# Altium project sine_wave_inverter.PrjPcb
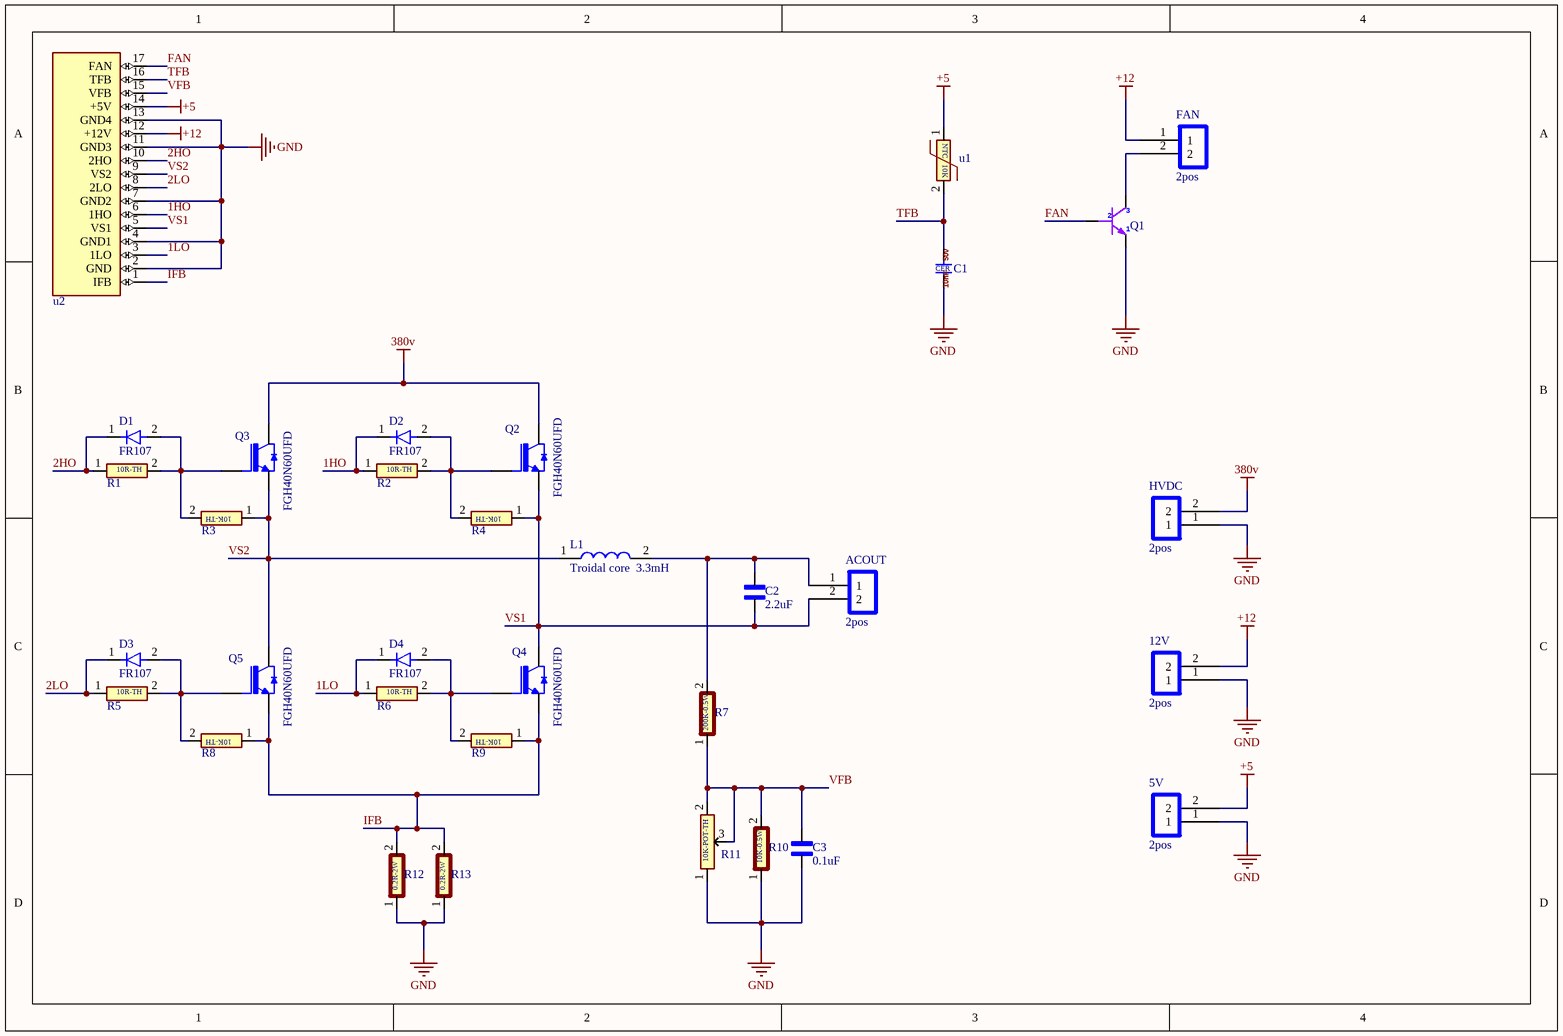
[diagram p0: inverter.SchDoc]
1 sheet, 33 parts. Net scope: global (net labels, ports and power ports of the same name join across sheets).
Board file: inverter.PcbDoc

## Sheet inverter.SchDoc
size A4; SheetNumber: 1; SheetTotal: 1

### Parts
5V  2pos  [2POS]
12V  2pos  [2POS]
ACOUT  2pos  [2POS - 3]
C1  10NFCER  [CAP-CER-2.54]  (value not drawn)
C2  2.2uF  [Cap_TH L23]
C3  0.1uF  [CAP-P_Pilm]
D1  FR107  [DIOAD1036W78L470D235]
D2  FR107  [DIOAD1036W78L470D235]
D3  FR107  [DIOAD1036W78L470D235]
D4  FR107  [DIOAD1036W78L470D235]
FAN  2pos  [2POS]
HVDC  2pos  [2POS - 3]
L1  Troidal core  3.3mH  [TOROIDAL CORE INDUCTOR]
Q1  SS8050  [TO-92]  (value not drawn)
Q2  FGH40N60UFD  [TO-247-3LD]
Q3  FGH40N60UFD  [TO-247-3LD]
Q4  FGH40N60UFD  [TO-247-3LD]
Q5  FGH40N60UFD  [TO-247-3LD]
R1  10R  [RES-TH-7mm]  (value not drawn)
R2  10R  [RES-TH-7mm]  (value not drawn)
R3  10K  [RES-TH-7mm]  (value not drawn)
R4  10K  [RES-TH-7mm]  (value not drawn)
R5  10R  [RES-TH-7mm]  (value not drawn)
R6  10R  [RES-TH-7mm]  (value not drawn)
R7  RES-0.5W-200K  [RES_TH 3W]  (value not drawn)
R8  10K  [RES-TH-7mm]  (value not drawn)
R9  10K  [RES-TH-7mm]  (value not drawn)
R10  RES-0.5W-10K  [RES_TH 3W]  (value not drawn)
R11  10K  [TRIM_3296W-1-250]  (value not drawn)
R12  RES-2W-2.1RRES-3W-0.2R  [RES_TH 3W]  (value not drawn)
R13  RES-2W-2.1RRES-3W-0.2R  [RES_TH 3W]  (value not drawn)
u1  10K  [NTC-TH L6.5]  (value not drawn)
u2  EGS002  [PinHeader_1x17_P2.54mm]  (value not drawn)

### Nets
380v: HVDC.2 Q2.2(C) Q3.2(C)
+5: 5V.2 u1.1 u2.14(+5V)
+12: 12V.2 FAN.1 u2.12(+12V)
GND: 5V.1 12V.1 C1.1 C3.1 HVDC.1 Q1.1(E) R10.1 R11.1 R12.1 R13.1 u2.2(GND) u2.4(GND1) u2.7(GND2) u2.11(GND3) u2.13(GND4)
1HO: D2.1 R2.1 u2.6(1HO)
1LO: D4.1 R6.1 u2.3(1LO)
2HO: D1.1 R1.1 u2.10(2HO)
2LO: D3.1 R5.1 u2.8(2LO)
FAN: Q1.2(B) u2.17(FAN)
IFB: Q4.3(E) Q5.3(E) R8.1 R9.1 R12.2 R13.2 u2.1(IFB)
TFB: C1.2 u1.2 u2.16(TFB)
VFB: C3.2 R7.1 R10.2 R11.2(B) R11.3 u2.15(VFB)
VS1: ACOUT.2 C2.1 Q2.3(E) Q4.2(C) R4.1 u2.5(VS1)
VS2: L1.1 Q3.3(E) Q5.2(C) R3.1 u2.9(VS2)
NetACOUT_1: ACOUT.1 C2.2 L1.2 R7.2
NetD1_2: D1.2 Q3.1(G) R1.2 R3.2
NetD2_2: D2.2 Q2.1(G) R2.2 R4.2
NetD3_2: D3.2 Q5.1(G) R5.2 R8.2
NetD4_2: D4.2 Q4.1(G) R6.2 R9.2
NetFAN_2: FAN.2 Q1.3(C)

### Notes on the sheet
- (in symbol 10K) 10K-TH
- (in symbol 10K POT) 10K-POT-TH
- (in symbol 10NFCER) 50v; CER; 10nF
- (in symbol 10R) 10R-TH
- (in symbol NTC 10K) NTC   10K
- (in symbol RES-0.5W-10K) 10K-0.5W
- (in symbol RES-0.5W-200K) 200K-0.5W
- (in symbol RES-2W-0.2R) 0.2R-2W

### Library data of the parts
5V 12V ACOUT FAN HVDC = 2pos: P2.54mm
C1 = 10NFCER: CAP: CER 1UF 50V X7R 1206; LCSC Part #: C1848; Unit Price: 0.0104
C2 = 2.2uF_film capacitor: Cap flim 2.2uF 400V; MF: KYOCERA AVX; MP: SR201C104KARTR1; SnapEDA_Link: https://www.snapeda.com/parts/SR201C104KARTR1/Kyocera/view-part/?ref=snap; Package: None; Value: *; Check_prices: https://www.snapeda.com/parts/SR201C104KARTR1/Kyocera/view-part/?ref=eda
C3 = 0.1uF_film: Cap Ceramic 0.1uF 100V X7R 10% Radial 2.54mm 125Â°C T/R; MF: KYOCERA AVX; MP: SR201C104KARTR1; SnapEDA_Link: https://www.snapeda.com/parts/SR201C104KARTR1/Kyocera/view-part/?ref=snap; Package: None; Value: *; Check_prices: https://www.snapeda.com/parts/SR201C104KARTR1/Kyocera/view-part/?ref=eda
D1-D4 = FR107: DIODE: GEN 1A 1.0V@1A 1kV DO-41 TH; LCSC Part #: C36138; Unit Price: 0.0313
L1 = Inductor: Troidal core  inductor: 220uH
Q1 = SS8050: Transistor: 25V 300mW 120@100mA,1V 1.5A NPN SOT-23; LCSC Part #: C59205; Unit Price: 0.0048
Q2-Q5 = FGH40N60UFD: FGH40N60UFD: 600V Field-Stop IGBT with ultrafast co-pack diode, 40A class, VCE(sat) typ 1.8V @ 40A/15V, TO-247-3LD (short lead) package.; LCSC Part #: C274639; Unit Price: 0.2595
R1 R2 R5 R6 = 10R: RES TH: 10R
R3 R4 R8 R9 = 10K: RES TH: 10K
R7 = RES-0.5W-200K: RES: 200K OHM 1% 0.5W TH
R10 = RES-0.5W-10K: RES: 10K OHM 1% 0.5W TH
R11 = 10K POT: RES TH: 10K POT
R12 R13 = RES-2W-0.2R: RES: 0.2OHM 1% 2W TH
u1 = NTC 10K: NTC TH: 10K
u2 = EGS002: EGS002 SPWM Pure Sine Wave Inverter Driver Board